# EAGLE schematic peelight-final (EAGLE 9.5.2)
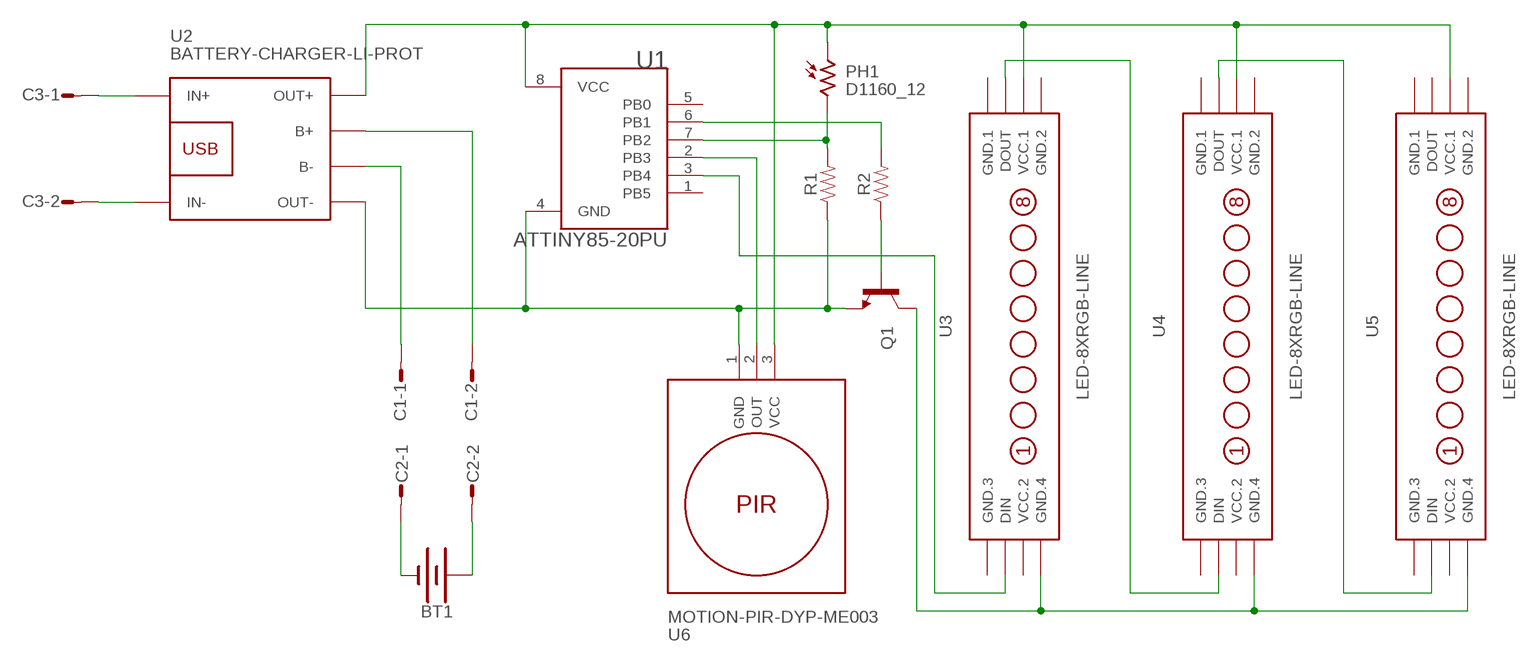
[diagram p0: schematic, sheet 1]

## Parts
BT1  BATTERY-18650  [BATTERY_18650-HOLDER]
C1  L02P  [L02P]
C2  S02P  [S02P]
C3  S02P  [S02P]
PH1  D1160_12  [D11XX]
Q1  SS8050CTA  [TO92127P520H538-3]
R1  RESISTORAXIAL-0.3  [AXIAL-0.3]
R2  RESISTORAXIAL-0.3  [AXIAL-0.3]
U1  ATTINY85-20PU  [DIP762W46P254L927H533Q8B]
U2  BATTERY-CHARGER-LI-PROT  [BATTERY-CHARGER-LI-PROT]
U3  LED-8XRGB-LINE  [LED-8XRGB-LINE]
U4  LED-8XRGB-LINE  [LED-8XRGB-LINE]
U5  LED-8XRGB-LINE  [LED-8XRGB-LINE]
U6  MOTION-PIR-DYP-ME003  [MOTION-PIR-DYP-ME003]

## Nets
N$1: C1.2 U2.B+
N$2: C1.1 U2.B-
N$3: PH1.1 U1.8(VCC) U2.OUT+ U3.A.3(VCC.1) U4.A.3(VCC.1) U5.A.3(VCC.1) U6.3(VCC)
N$4: Q1.1(E) R1.P$1 U1.4(GND) U2.OUT- U6.1(GND)
N$5: PH1.2 R1.P$2 U1.7(PB2)
N$6: U1.2(PB3) U6.2(OUT)
N$7: U3.A.2(DOUT) U4.B.2(DIN)
N$8: U4.A.2(DOUT) U5.B.2(DIN)
N$9: U1.3(PB4) U3.B.2(DIN)
N$10: BT1.GND@1(-) C2.1
N$11: BT1.PWR@1(+) C2.2
N$12: C3.2 U2.IN-
N$13: C3.1 U2.IN+
N$14: Q1.3(C) U3.B.4(GND.4) U4.B.4(GND.4) U5.B.4(GND.4)
N$15: R2.P$2 U1.6(PB1)
N$16: Q1.2(B) R2.P$1
Unconnected: U1.1(PB5) U1.5(PB0) U5.A.2(DOUT)

## Power pins joined to a net without a drawn wire
GND.1: U3.A.1(GND.1) U4.A.1(GND.1) U5.A.1(GND.1)
GND.2: U3.A.4(GND.2) U4.A.4(GND.2) U5.A.4(GND.2)
GND.3: U3.B.1(GND.3) U4.B.1(GND.3) U5.B.1(GND.3)
VCC.2: U3.B.3(VCC.2) U4.B.3(VCC.2) U5.B.3(VCC.2)

## Library data of the parts
BT1 = SparkFun-Batteries:BATTERY: Battery - Single Cell A variety of battery chemistries, sizes, and footprints. Device List: 20MM_PTH - Coin Cell Battery Holder - 20mm (PTH) <https://www.sparkfun.com/products/783> 6.8MM_PTH - Coin Cell Battery Holder - 6.8MM(SMD) <https://www.digikey.com/product-detail/en/seiko-instruments/MS621FE-FL11E/728-1057-ND/1889208?WT.srch=1&gclid=CNOQ5a6LzdQCFZS2wAodXCkE0g> 12MM_SMD - Coin Cell Battery Holder - 12mm (SMD) <https://www.sparkfun.com/products/10592> 12MM_PTH - Coin Cell Battery Holder - 12mm (PTH) <https://www.sparkfun.com/products/7948> 20MM_SMD - 20mm Coin Cell Battery Holder (SMD) (2 legs) Used on the Big Time Watch Kit <https://www.sparkfun.com/products/11734> 20MM_SMD_4LEGS - Coin Cell Battery Holder - 20mm (SMD) <https://www.sparkfun.com/products/11892> 20MM_SMD_4LEGS_OVERPASTE - Coin Cell Battery Holder - 20mm (SMD) <https://www.sparkfun.com/products/11892> (Over-paste on the legs) 24.5MM_PTH - Coin Cell Battery Holder - 24.5mm (PTH) <https://www.sparkfun.com/products/8863> 9V - 9V Battery Holder - PC Mount Used on the SparkFun SparkPunk Sound Kit <https://www.sparkfun.com/products/11177> and SparkFun SparkPunk Sequencer Kit <https://www.sparkfun.com/products/12707> 18650 - Battery Holder - 18650 (PTH) <https://www.sparkfun.com/products/13113> AA - Battery Holder - 1xAA (PTH) <https://www.sparkfun.com/products/7949> AAA - Battery Holder - 1xAAA (PTH) <https://www.sparkfun.com/products/12718> AA_KIT - Battery Holder - 1xAA (PTH) <https://www.sparkfun.com/products/7949> Special kit package - pads only have exposed copper on one side of the board. AAA_KIT - Battery Holder - 1xAAA (PTH) <https://www.sparkfun.com/products/12718> Special kit package - pads only have exposed copper on one side of the board.; PROD_ID: BATT-12327; SF_SKU: PRT-13113
C1 = con-amp-mt:L02P: AMP MT CONNECTOR; OC_FARNELL: unknown; OC_NEWARK: unknown
C2 C3 = con-amp-mt:S02P: AMP MT CONNECTOR; OC_FARNELL: unknown; OC_NEWARK: unknown
PH1 = photo-elements:D11: Photo Sensor Oil Burner Control Applications Source: http://optoelectronics.perkinelmer.com/content/Datasheets/DTS_PhotocellsD1160.pdf
Q1 = SS8050CTA:SS8050CTA: SS8050 Series 25 V CE Breakdown 1.2 A NPN Epitaxial Silicon Transistor - TO-92; AVAILABILITY: Unavailable; DESCRIPTION: SS8050 Series 25 V CE Breakdown 1.2 A NPN Epitaxial Silicon Transistor - TO-92; MF: ON Semiconductor; MP: SS8050CTA; PACKAGE: TO-92 ON Semiconductor; PRICE: None
R1 R2 = SparkFun-Resistors:RESISTOR: Generic Resistor Package
U1 = ATTINY85-20PU:ATTINY85-20PU: ATtiny Series 20 MHz 8 KB Flash 512 B SRAM 8-Bit Microcontroller - DIP-8; AVAILABILITY: Unavailable; DESCRIPTION: ATtiny Series 20 MHz 8 KB Flash 512 B SRAM 8-Bit Microcontroller - DIP-8; MF: Microchip; MP: ATTINY85-20PU; PACKAGE: DIP-8 Microchip; PRICE: None
U2 = diy-modules:BATTERY-CHARGER-LI-PROT: Lithium Battery 5V Charger with protection circuit More details available here: http://www.instructables.com/id/DIY-Lithium-ion-Battery-Charger/step4/TP4056-based-lithium-ion-battery-charger-module/ Click here to find device on ebay.com <http://www.ebay.com/sch/tp4056+charger+usb+protection>
U3-U5 = diy-modules:LED-8XRGB-LINE: 8 LEDs RGB Line Display based on WS2812B More details about controlling WS2812B RGB LEDs are available here: https://learn.sparkfun.com/tutorials/ws2812-breakout-hookup-guide Click here to find device on ebay.com <http://www.ebay.com/sch/ws2812+8+bit+rainbow>
U6 = diy-modules:MOTION-PIR-DYP-ME003: PIR Motion Sensor Module DYP-ME003 based on BISS0001 pyroelectic detector Click here to find device on ebay.com <http://www.ebay.com/sch/dyp+me003>